# Altium schematic sheet Connectors.SchDoc: Connectors
size OrCAD A; DocumentNumber: LM-003; Revision: 3.0; SheetNumber: 3; SheetTotal: 5
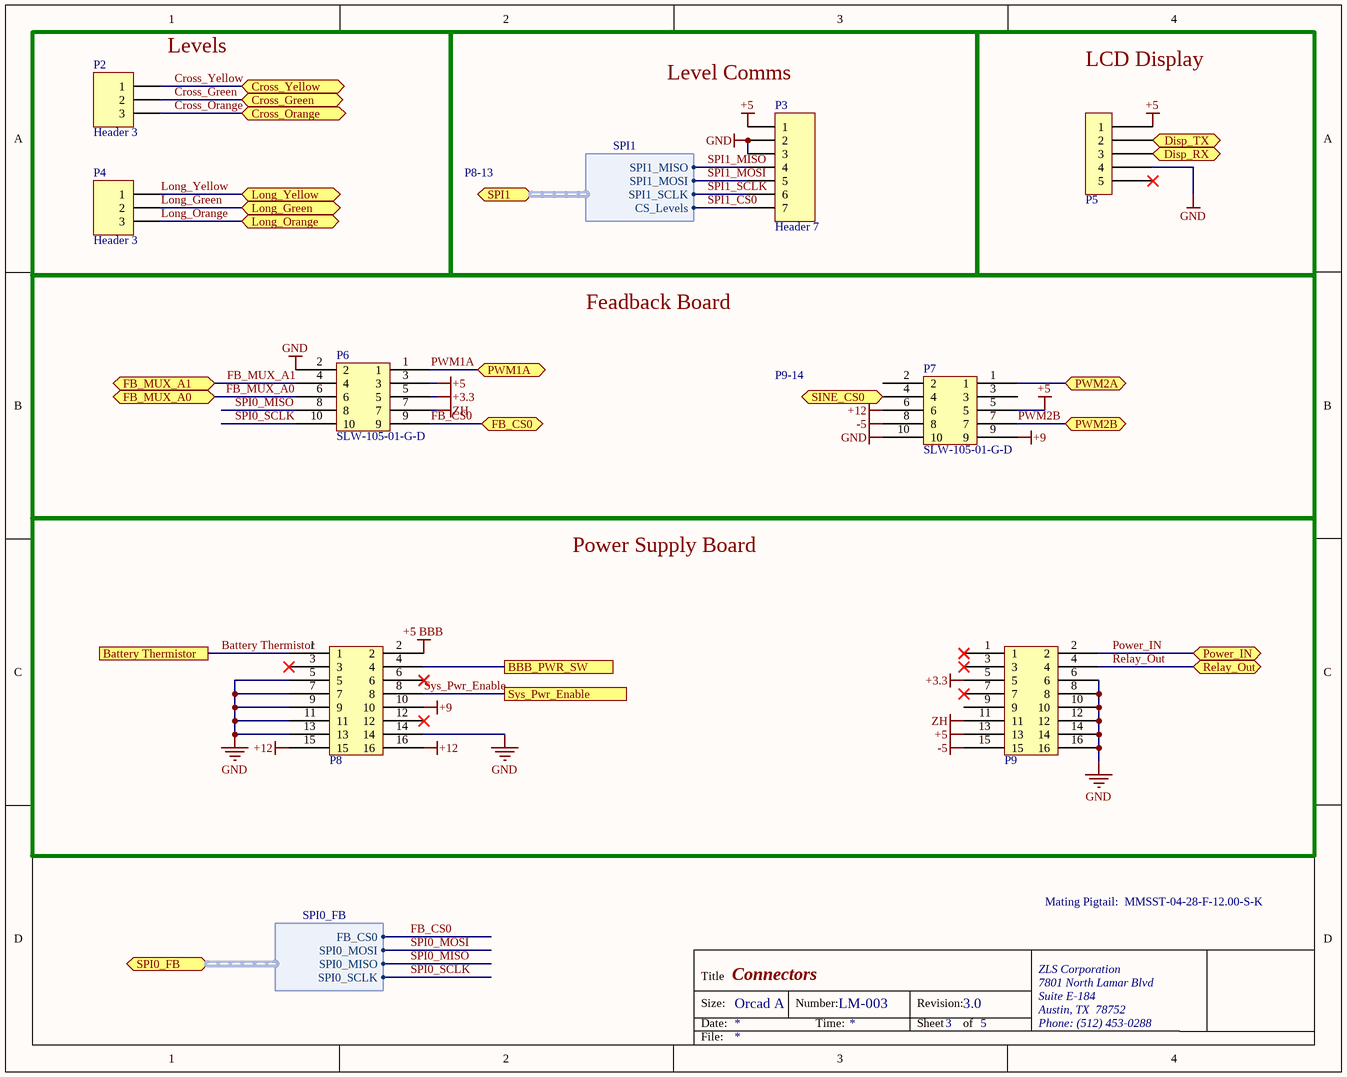
[diagram p0: Connectors.SchDoc]

## Parts
P2  Header 3  [HDR1X3]
P3  Header 7  [HDR1X7]
P4  Header 3  [HDR1X3]
P5  IPL1-105-01-F-S-K  [IPL1-105-01-F-S-K]  (value not drawn)
P6  SLW-105-01-G-D  [SLW-105-01-G-D]
P7  SLW-105-01-G-D  [SLW-105-01-G-D]
P8  SLW-108-01-G-D  [SLW-108-01-G-D]  (value not drawn)
P9  SLW-108-01-G-D  [SLW-108-01-G-D]  (value not drawn)

## Blocks framed on the sheet
Levels: P2 P4
Level Comms: P3
LCD Display: P5
Feadback Board: P6 P7
Power Supply Board: P8 P9

## Ports
Battery Thermistor, BBB_PWR_SW, Cross_Green, Cross_Orange, Cross_Yellow, Disp_RX, Disp_TX, FB_CS0, FB_MUX_A0, FB_MUX_A1, Long_Green, Long_Orange, Long_Yellow, Power_IN, PWM1A, PWM2A, PWM2B, Relay_Out, SINE_CS0, SPI0_FB (harness SPI0_FB), SPI1 (harness SPI1), Sys_Pwr_Enable

## Harnesses
SPI1: CS_Levels, SPI1_MISO, SPI1_MOSI, SPI1_SCLK
SPI0_FB: FB_CS0, SPI0_MOSI, SPI0_MISO, SPI0_SCLK

## Nets
+3.3: P6.5 P9.5
+5: P3.1 P5.1 P6.3 P7.5 P9.13
+5 BBB: P8.2
+9: P7.9 P8.10
+12: P7.6 P8.15 P8.16
-5: P7.8 P9.15
GND: P3.2 P3.3 P5.4 P6.2 P7.10 P8.5 P8.7 P8.9 P8.11 P8.13 P8.14 P9.6 P9.8 P9.10 P9.12 P9.14 P9.16
ZH: P6.7 P9.11
Battery Thermistor: P8.1 ; port Battery Thermistor
BBB_PWR_SW: P8.4 ; port BBB_PWR_SW
Cross_Green: P2.2 ; port Cross_Green
Cross_Orange: P2.3 ; port Cross_Orange
Cross_Yellow: P2.1 ; port Cross_Yellow
Disp_RX: P5.3 ; port Disp_RX
Disp_TX: P5.2 ; port Disp_TX
FB_CS0: P6.9 ; port FB_CS0, port SPI0_FB.FB_CS0
FB_MUX_A0: P6.6 ; port FB_MUX_A0
FB_MUX_A1: P6.4 ; port FB_MUX_A1
Long_Green: P4.2 ; port Long_Green
Long_Orange: P4.3 ; port Long_Orange
Long_Yellow: P4.1 ; port Long_Yellow
Power_IN: P9.2 ; port Power_IN
PWM1A: P6.1 ; port PWM1A
PWM2A: P7.1 ; port PWM2A
PWM2B: P7.7 ; port PWM2B
Relay_Out: P9.4 ; port Relay_Out
SINE_CS0: P7.4 ; port SINE_CS0
SPI0_MISO: P6.8 ; port SPI0_FB.SPI0_MISO
SPI0_MOSI: port SPI0_FB.SPI0_MOSI
SPI0_SCLK: P6.10 ; port SPI0_FB.SPI0_SCLK
SPI1_CS0: P3.7 ; port SPI1.CS_Levels
SPI1_MISO: P3.4 ; port SPI1.SPI1_MISO
SPI1_MOSI: P3.5 ; port SPI1.SPI1_MOSI
SPI1_SCLK: P3.6 ; port SPI1.SPI1_SCLK
Sys_Pwr_Enable: P8.8 ; port Sys_Pwr_Enable

Not connected (* = marked no-connect by the designer): P5 5*; P7 2 3; P8 3* 6* 12*; P9 1* 3* 7* 9

## Notes on the sheet
- P8-13
- P9-14
- Mating Pigtail:  MMSST-04-28-F-12.00-S-K
- Title
- Size:
- Date:
- Orcad A
- Number:
- Time:
- Revision:
- Sheet
- of
- ZLS Corporation
- 7801 North Lamar Blvd
- Suite E-184
- Austin, TX  78752
- Phone: (512) 453-0288
- File:

## Library data of the parts
P2 P4 = Header 3: Header, 3-Pin; LatestRevisionDate: 17-Jul-2002; LatestRevisionNote: Re-released for DXP Platform.; Publisher: Altium Limited
P3 = Header 7: Header, 7-Pin; LatestRevisionDate: 17-Jul-2002; LatestRevisionNote: Re-released for DXP Platform.; Publisher: Altium Limited
P6 P7 = SLW-105-01-G-D: CONN RCPT .100" 10POS DUAL GOLD; Manufacturer: Samtec Inc.; Connector Type: Receptacle; Style: Board to Board; Number of Positions: 10; Number of Positions Loaded: All; Pitch - Mating: 0.100" (2.54mm); Contact Length - Post: 0.115" (2.92mm); Mated Stacking Heights: 6.09mm; Supplier 1: Digi-Key; Supplier Part Number 1: SAM1088-05-ND; Manufacturer Part Number: SLW-105-01-G-D; RoHS: RoHS Compliant; Category: Connectors, Interconnects; Stock 1: 203; Pricing 1: 1=3.8, 10=3.401, 100=2.8012, 500=2.2143, 1000=1.90084, 5000=1.7341, 10000=1.6674 (USD); Packaging: Bulk; Part Status: Active; Contact Type: Forked; Row Spacing - Mating: 0.100" (2.54mm); Mounting Type: Through Hole; Termination: Solder; Fastening Type: Push-Pull; Contact Finish - Mating: Gold; Contact Finish Thickness - Mating: 20µin (0.51µm); Insulation Color: Black; Insulation Height: 0.180" (4.57mm); Operating Temperature: -55°C ~ 125°C; Material Flammability Rating: -; Contact Finish - Post: Gold; Ingress Protection: -; Features: -; Current Rating: -; Voltage Rating: -; Applications: -; Insulation Material: Polyester, Glass Filled; Contact Shape: Square; Contact Material: Phosphor Bronze; Contact Finish Thickness - Post: 3µin (0.08µm); ComponentLink1URL: http://suddendocs.samtec.com/prints/slw-1xx-01-x-x-mkt.pdf; ComponentLink1Description: http://suddendocs.samtec.com/prints/slw-1xx-01-x-x-mkt.pdf
P5 = IPL1-105-01-F-S-K: Supplier 1: Newark; Supplier Part Number 1: 99R3297
P8 P9 = SLW-108-01-G-D: Supplier 1: Digi-Key